# EAGLE schematic SparkFun_MOSFET_Power_Control_Kit (EAGLE 6.4)
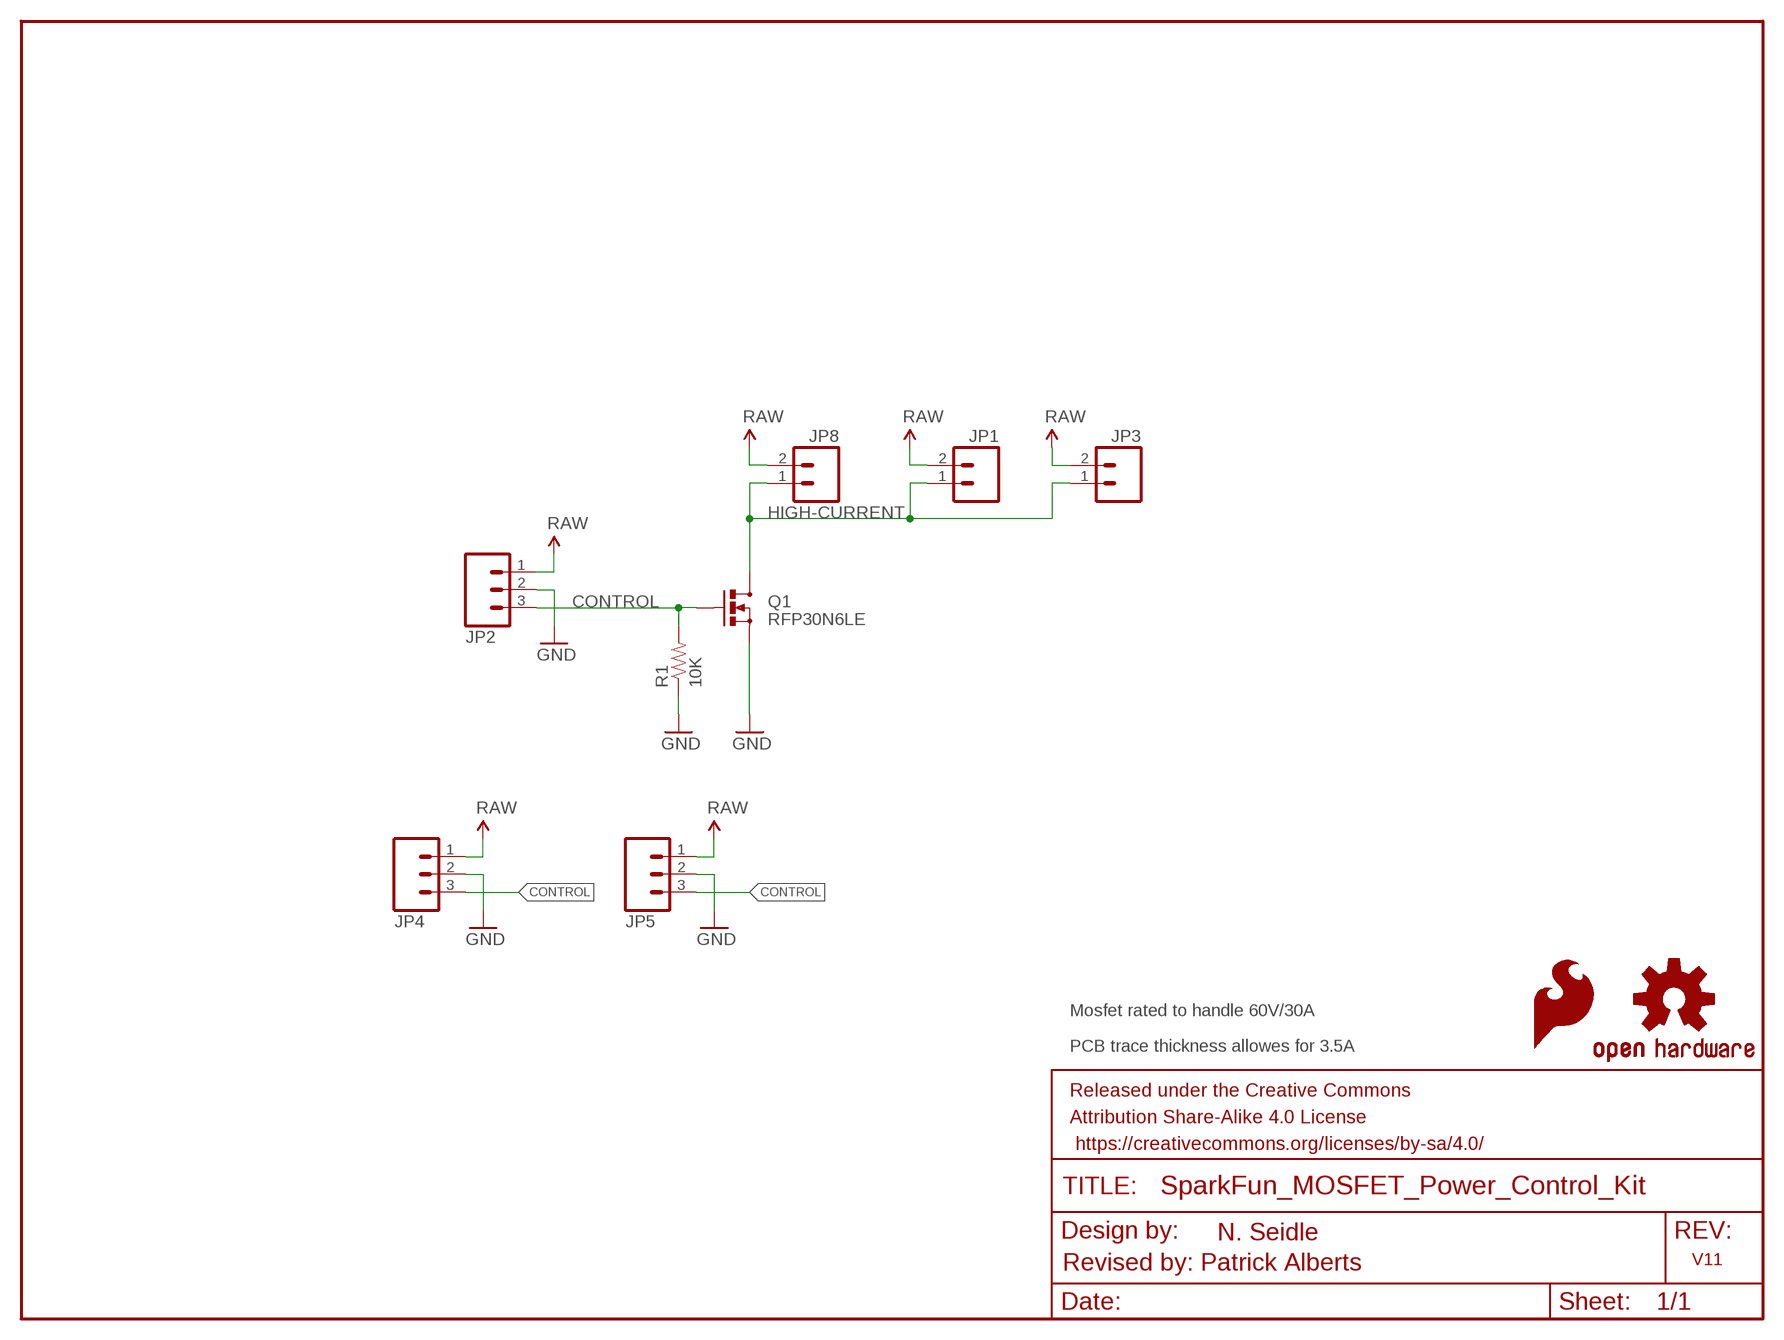
[diagram p0: schematic, sheet 1]

## Parts
FRAME1  FRAME-LETTER  [CREATIVE_COMMONS]
JP1  M023.5MM  [SCREWTERMINAL-3.5MM-2]
JP2  M03JST-PTH  [JST-3-PTH]
JP3  M02PTH  [1X02]
JP4  M03SCREW  [SCREWTERMINAL-3.5MM-3]
JP5  M03PTH  [1X03]
JP8  M02JST-PTH-2  [JST-2-PTH]
LOGO1  OSHW-LOGOS  [OSHW-LOGO-S]
LOGO2  SFE_LOGO_FLAME.1_INCH  [SFE_LOGO_FLAME_.1]
Q1  RFP30N6LE  MOSFET-NCHANNELPTH2  [TO220V]
R1  10K  RESISTORPTH1  [AXIAL-0.3]

## Nets
CONTROL: JP2.3 JP4.3 JP5.3 Q1.1(G) R1.P$2
GND: JP2.2 JP4.2 JP5.2 Q1.3(S) R1.P$1
HIGH-CURRENT: JP1.1 JP3.1 JP8.1 Q1.2(D)
VCC: JP1.2 JP2.1 JP3.2 JP4.1 JP5.1 JP8.2 ; supply symbol labelled RAW

## Notes on the sheet
- Mosfet rated to handle 60V/30A
- PCB trace thickness allowes for 3.5A
- N. Seidle
- V11
- Revised by: Patrick Alberts

## Library data of the parts
FRAME1 = SparkFun-Aesthetics:FRAME-LETTER: Schematic Frame Standard 8.5x11 US Letter frame
JP1 JP8 = SparkFun:M02: Header 2 Standard 2-pin 0.1" header. Use with straight break away headers (SKU : PRT-00116), right angle break away headers (PRT-00553), swiss pins (PRT-00743), machine pins (PRT-00117), and female headers (PRT-00115). Molex polarized connector foot print use with SKU : PRT-08233 with associated crimp pins and housings.
JP2 JP4 JP5 = SparkFun:M03: Header 3 Standard 3-pin 0.1" header. Use with straight break away headers (SKU : PRT-00116), right angle break away headers (PRT-00553), swiss pins (PRT-00743), machine pins (PRT-00117), and female headers (PRT-00115). Molex polarized connector foot print use with SKU : PRT-08232 with associated crimp pins and housings.
JP3 = SparkFun-Connectors:M02: Standard 2-pin 0.1" header. Use with - straight break away headers ( PRT-00116) - right angle break away headers (PRT-00553) - swiss pins (PRT-00743) - machine pins (PRT-00117) - female headers (PRT-00115) Molex polarized connector foot print use with: PRT-08233 with associated crimp pins and housings. 2.54_SCREWTERM for use with PRT-10571. 3.5mm Screw Terminal footprints for PRT-08084 5mm Screw Terminal footprints for use with PRT-08433
LOGO1 = SparkFun-Aesthetics:OSHW-LOGO: Open Source Hardware Logo This logo indicates the piece of hardware it is found on incorporates a OSHW license and/or adheres to the definition of open source hardware found here: http://freedomdefined.org/OSHW
LOGO2 = SparkFun-Aesthetics:SFE_LOGO_FLAME: SFE Logo, flame only This is the SparkFun flame logo. The logo on the schematic will always be the same size; the package variant is the height of the flame. Default layer for the logo on the board is tSilk.
Q1 = SparkFun:MOSFET-NCHANNEL
R1 = SparkFun:RESISTOR: Resistor Basic schematic elements and footprints for 0603, 1206, and PTH 1/10th watt (small) resistors.